# EAGLE design xboxhdmi (EAGLE 9.6.2)
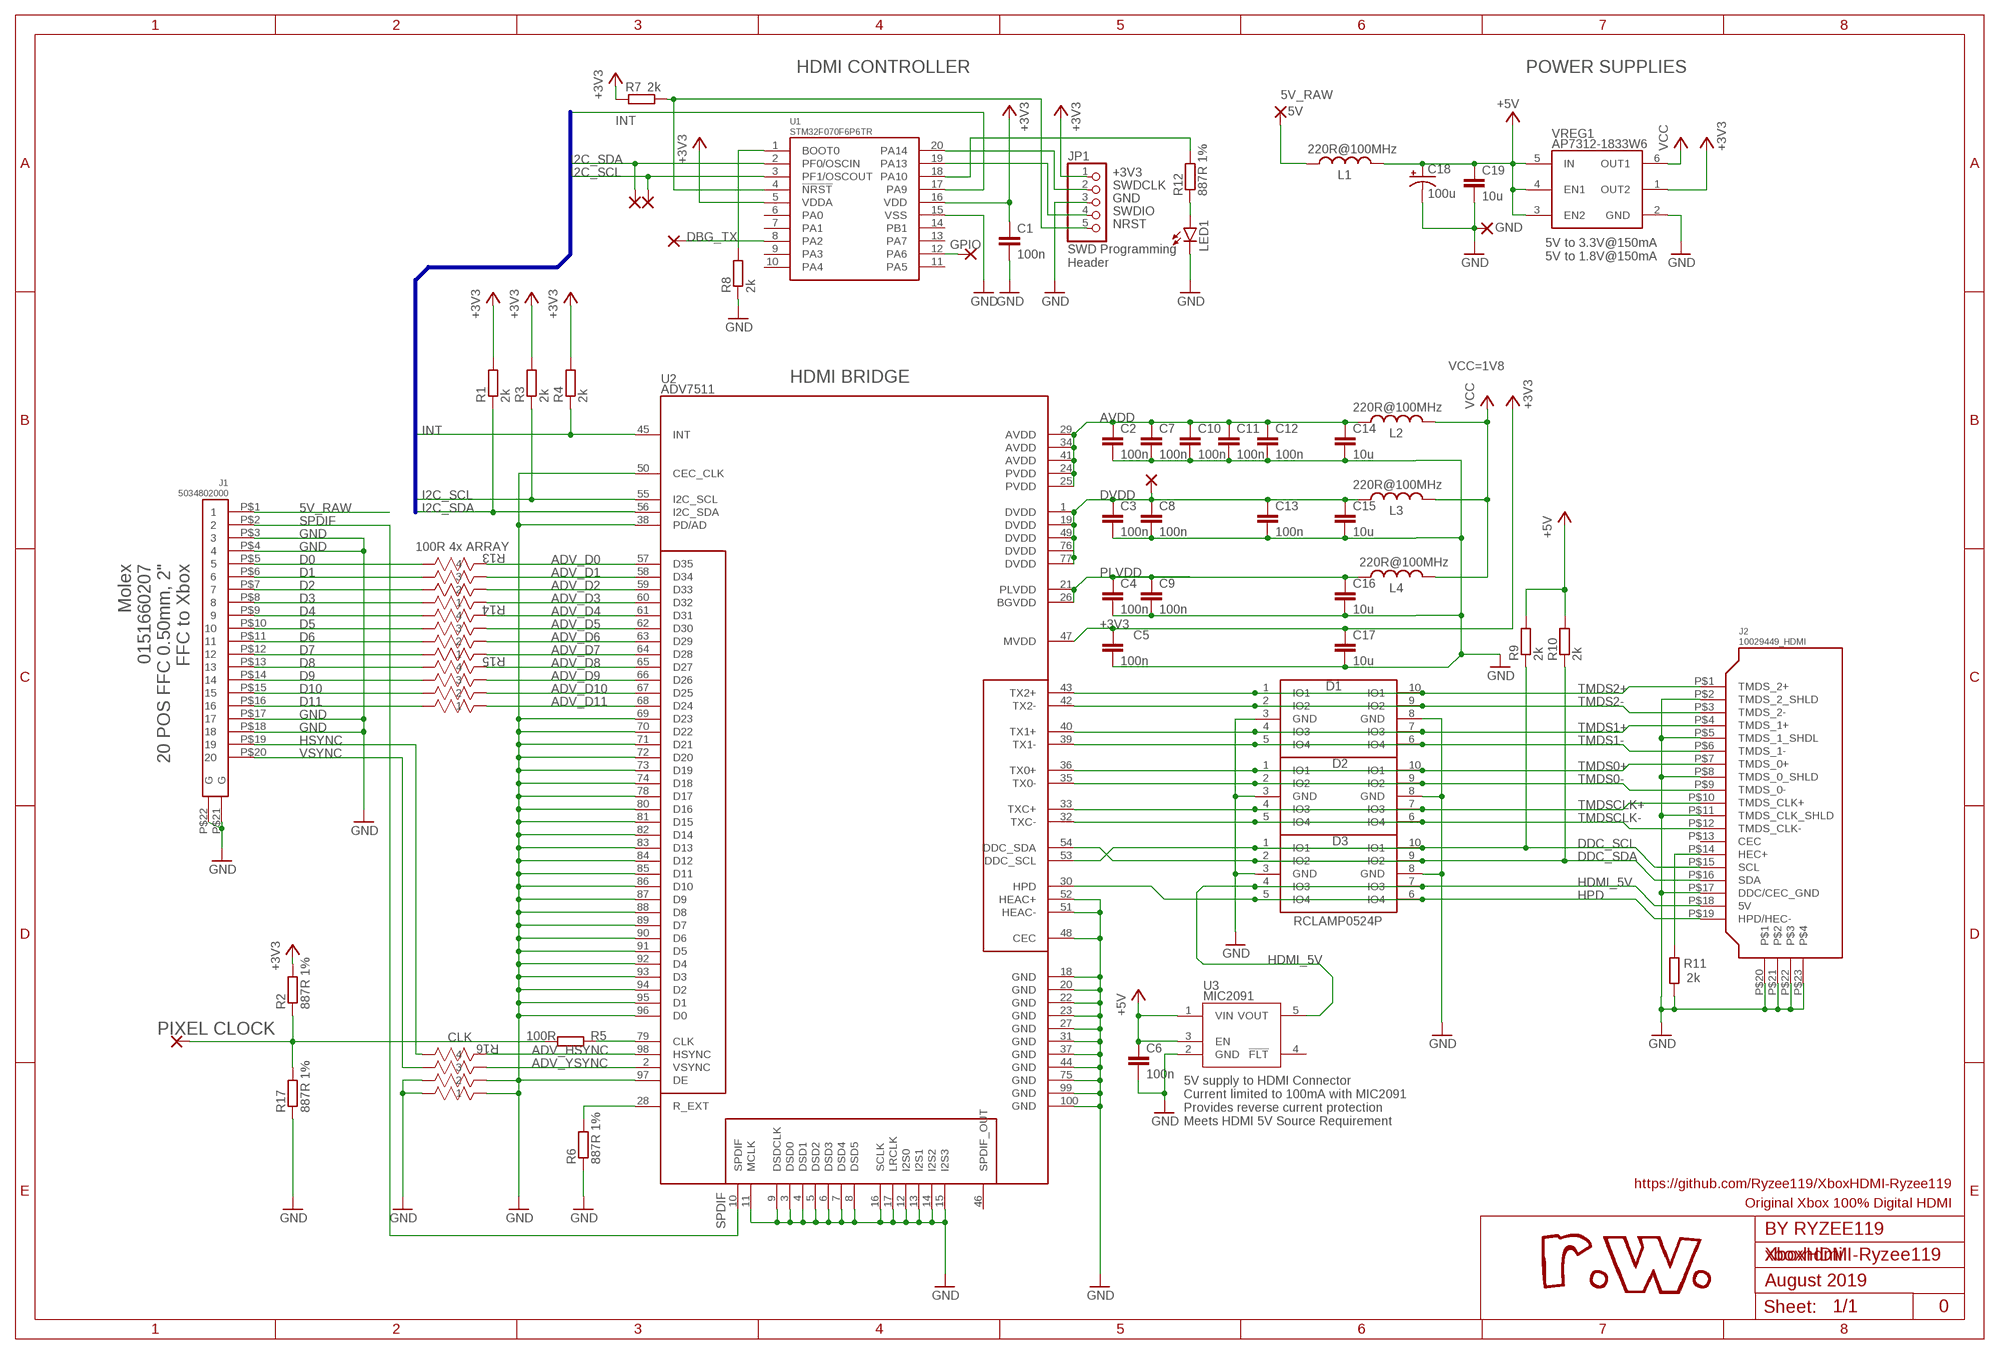
[diagram p0: schematic, sheet 1]

## Parts
1V8  SMD2  [SMD1,27-2,54]
5V  SMD2  [SMD1,27-2,54]
C1  100n  C-EUC0603  [C0603]
C2  100n  C-EUC0603  [C0603]
C3  100n  C-EUC0603  [C0603]
C4  100n  C-EUC0603  [C0603]
C5  100n  C-EUC0603  [C0603]
C6  100n  C-EUC0603  [C0603]
C7  100n  C-EUC0603  [C0603]
C8  100n  C-EUC0603  [C0603]
C9  100n  C-EUC0603  [C0603]
C10  100n  C-EUC0603  [C0603]
C11  100n  C-EUC0603  [C0603]
C12  100n  C-EUC0603  [C0603]
C13  100n  C-EUC0603  [C0603]
C14  10u  C-EUC1206  [C1206]
C15  10u  C-EUC1206  [C1206]
C16  10u  C-EUC1206  [C1206]
C17  10u  C-EUC1206  [C1206]
C18  100u  CPOL-US153CLV-0505  [153CLV-0505]
C19  10u  C-EUC1206  [C1206]
CLK  SMD2  [SMD1,27-2,54]
D1  RCLAMP0524P  [DIOCAF50P250X100X65-10]
D2  RCLAMP0524P  [DIOCAF50P250X100X65-10]
D3  RCLAMP0524P  [DIOCAF50P250X100X65-10]
GND  SMD2  [SMD1,27-2,54]
J1  5034802000  [5034802000]
J2  10029449_HDMI  [HDMI_10029449]
JP1  PINHD-1X5  [1X05]
L1  220R@100MHz  INDUCTOR-0603  [C0603]
L2  220R@100MHz  INDUCTOR-0603  [C0603]
L3  220R@100MHz  INDUCTOR-0603  [C0603]
L4  220R@100MHz  INDUCTOR-0603  [C0603]
LED1  LEDCHIP-LED0603  [CHIP-LED0603]
PAD3  SMD2  [SMD1,27-2,54]
PAD4  SMD2  [SMD1,27-2,54]
PAD5  SMD2  [SMD1,27-2,54]
R1  2k  R-EU_R0603  [R0603]
R2  887R 1%  R-EU_R0603  [R0603]
R3  2k  R-EU_R0603  [R0603]
R4  2k  R-EU_R0603  [R0603]
R5  100R  R-EU_R0603  [R0603]
R6  887R 1%  R-EU_R0603  [R0603]
R7  2k  R-EU_R0603  [R0603]
R8  2k  R-EU_R0603  [R0603]
R9  2k  R-EU_R0603  [R0603]
R10  2k  R-EU_R0603  [R0603]
R11  2k  R-EU_R0603  [R0603]
R12  887R 1%  R-EU_R0603  [R0603]
R13  YC124-JR-0733RL  [YAG_YC124]
R14  YC124-JR-0733RL  [YAG_YC124]
R15  YC124-JR-0733RL  [YAG_YC124]
R16  YC124-JR-0733RL  [YAG_YC124]
R17  887R 1%  R-EU_R0603  [R0603]
TX  SMD2  [SMD1,27-2,54]
U1  STM32F070F6P6TR  [TSSOP20]
U2  ADV7511  [LQFP100]
U3  MIC2091  [SOT23-5]
VREG1  AP7312-1833W6  [SOT23-6]

## Nets
5V_RAW: 5V.1(P) J1.P$1 L1.1
+3V3: C1.1 C5.1 C17.1 JP1.1 R1.2 R2.2 R3.2 R4.2 R7.2 U1.5(VDDA) U1.16(VDD) U2.47(MVDD) VREG1.1(OUT2)
+5V: C6.1 C18.+ C19.1 L1.2 R9.2 R10.2 U3.1(VIN) U3.3(EN) VREG1.3(EN2) VREG1.4(EN1) VREG1.5(IN)
ADV_CLK: R5.1 U2.79(CLK)
ADV_D0: R13.4 U2.57(D35)
ADV_D1: R13.3 U2.58(D34)
ADV_D2: R13.2 U2.59(D33)
ADV_D3: R13.1 U2.60(D32)
ADV_D4: R14.4 U2.61(D31)
ADV_D5: R14.3 U2.62(D30)
ADV_D6: R14.2 U2.63(D29)
ADV_D7: R14.1 U2.64(D28)
ADV_D8: R15.4 U2.65(D27)
ADV_D9: R15.3 U2.66(D26)
ADV_D10: R15.2 U2.67(D25)
ADV_D11: R15.1 U2.68(D24)
ADV_HSYNC: R16.4 U2.98(HSYNC)
ADV_YSYNC: R16.3 U2.2(VSYNC)
AVDD: C2.1 C7.1 C10.1 C11.1 C12.1 C14.1 L2.1 U2.24(PVDD) U2.25(PVDD) U2.29(AVDD) U2.34(AVDD) U2.41(AVDD)
CLK: CLK.1(P) R2.1 R5.2 R17.2
D0: J1.P$5 R13.5
D1: J1.P$6 R13.6
D2: J1.P$7 R13.7
D3: J1.P$8 R13.8
D4: J1.P$9 R14.5
D5: J1.P$10 R14.6
D6: J1.P$11 R14.7
D7: J1.P$12 R14.8
D8: J1.P$13 R15.5
D9: J1.P$14 R15.6
D10: J1.P$15 R15.7
D11: J1.P$16 R15.8
DBG_TX: TX.1(P) U1.8(PA2)
DDC_SCL: D3.1(IO1) D3.10(IO1) J2.P$15(SCL) R9.1 U2.53(DDC_SCL)
DDC_SDA: D3.2(IO2) D3.9(IO2) J2.P$16(SDA) R10.1 U2.54(DDC_SDA)
DVDD: 1V8.1(P) C3.1 C8.1 C13.1 C15.1 L3.1 U2.1(DVDD) U2.19(DVDD) U2.49(DVDD) U2.76(DVDD) U2.77(DVDD)
GND: C1.2 C2.2 C3.2 C4.2 C5.2 C6.2 C7.2 C8.2 C9.2 C10.2 C11.2 C12.2 C13.2 C14.2 C15.2 C16.2 C17.2 C18.- C19.2 D1.3(GND) D1.8(GND) D2.3(GND) D2.8(GND) D3.3(GND) D3.8(GND) GND.1(P) J1.P$3 J1.P$4 J1.P$17 J1.P$18 J1.P$21(G) J1.P$22(G) J2.P$2(TMDS_2_SHLD) J2.P$5(TMDS_1_SHDL) J2.P$8(TMDS_0_SHLD) J2.P$11(TMDS_CLK_SHLD) J2.P$17(DDC/CEC_GND) J2.P$20 J2.P$21 J2.P$22 J2.P$23 JP1.3 LED1.C R6.1 R8.1 R11.1 R16.1 R16.2 R16.7 R16.8 R17.1 U1.15(VSS) U2.3(DSD0) U2.4(DSD1) U2.5(DSD2) U2.6(DSD3) U2.7(DSD4) U2.8(DSD5) U2.9(DSDCLK) U2.11(MCLK) U2.12(I2S0) U2.13(I2S1) U2.14(I2S2) U2.15(I2S3) U2.16(SCLK) U2.17(LRCLK) U2.18(GND) U2.20(GND) U2.22(GND) U2.23(GND) U2.27(GND) U2.31(GND) U2.37(GND) U2.38(PD/AD) U2.44(GND) U2.48(CEC) U2.50(CEC_CLK) U2.51(HEAC-) U2.52(HEAC+) U2.69(D23) U2.70(D22) U2.71(D21) U2.72(D20) U2.73(D19) U2.74(D18) U2.75(GND) U2.78(D17) U2.80(D16) U2.81(D15) U2.82(D14) U2.83(D13) U2.84(D12) U2.85(D11) U2.86(D10) U2.87(D9) U2.88(D8) U2.89(D7) U2.90(D6) U2.91(D5) U2.92(D4) U2.93(D3) U2.94(D2) U2.95(D1) U2.96(D0) U2.97(DE) U2.99(GND) U2.100(GND) U3.2(GND) VREG1.2(GND)
GPIO: PAD5.1(P) U1.12(PA6)
HDMI_5V: D3.4(IO3) D3.7(IO3) J2.P$18(5V) U3.5(VOUT)
HEC+: J2.P$14(HEC+) R11.2
HPD: D3.5(IO4) D3.6(IO4) J2.P$19(HPD/HEC-) U2.30(HPD)
HSYNC: J1.P$19 R16.5
I2C_SCL: PAD4.1(P) R3.1 U1.3(PF1/OSCOUT) U2.55(I2C_SCL)
I2C_SDA: PAD3.1(P) R1.1 U1.2(PF0/OSCIN) U2.56(I2C_SDA)
INT: R4.1 U1.17(PA9) U2.45(INT)
N$5: R12.2 U1.18(PA10)
N$6: LED1.A R12.1
N$35: R8.2 U1.1(BOOT0)
NRST: JP1.5 R7.1 U1.4(!NRST)
PLVDD: C4.1 C9.1 C16.1 L4.1 U2.21(PLVDD) U2.26(BGVDD)
R_EXT: R6.2 U2.28(R_EXT)
SPDIF: J1.P$2 U2.10(SPDIF)
SWDCLK: JP1.2 U1.20(PA14)
SWDIO: JP1.4 U1.19(PA13)
TMDS0+: D2.1(IO1) D2.10(IO1) J2.P$7(TMDS_0+) U2.36(TX0+)
TMDS0-: D2.2(IO2) D2.9(IO2) J2.P$9(TMDS_0-) U2.35(TX0-)
TMDS1+: D1.4(IO3) D1.7(IO3) J2.P$4(TMDS_1+) U2.40(TX1+)
TMDS1-: D1.5(IO4) D1.6(IO4) J2.P$6(TMDS_1-) U2.39(TX1-)
TMDS2+: D1.1(IO1) D1.10(IO1) J2.P$1(TMDS_2+) U2.43(TX2+)
TMDS2-: D1.2(IO2) D1.9(IO2) J2.P$3(TMDS_2-) U2.42(TX2-)
TMDSCLK+: D2.4(IO3) D2.7(IO3) J2.P$10(TMDS_CLK+) U2.33(TXC+)
TMDSCLK-: D2.5(IO4) D2.6(IO4) J2.P$12(TMDS_CLK-) U2.32(TXC-)
VCC: L2.2 L3.2 L4.2 VREG1.6(OUT1)
VSYNC: J1.P$20 R16.6
Unconnected: J2.P$13(CEC) U1.6(PA0) U1.7(PA1) U1.9(PA3) U1.10(PA4) U1.11(PA5) U1.13(PA7) U1.14(PB1) U2.46(SPDIF_OUT) U3.4(!FLT)

## Buses
I2C_SCL,I2C_SDA,INT

## Notes on the sheet
- HDMI CONTROLLER | POWER SUPPLIES
- 5V to 3.3V@150mA
  5V to 1.8V@150mA
- SWD Programming
  Header
- VCC=1V8
- HDMI BRIDGE
- 100R 4x ARRAY
- Molex
  0151660207
  20 POS FFC 0.50mm, 2"
  FFC to Xbox
- PIXEL CLOCK
- 5V supply to HDMI Connector
  Current limited to 100mA with MIC2091
  Provides reverse current protection
  Meets HDMI 5V Source Requirement
- https://github.com/Ryzee119/XboxHDMI-Ryzee119
- Original Xbox 100% Digital HDMI
- BY RYZEE119
- XboxHDMI-Ryzee119
- August 2019
- 0

## Library data of the parts
1V8 5V CLK GND PAD3-PAD5 TX = my-library:SMD2: SMD PAD
C1-C17 C19 = rcl:C-EU: CAPACITOR, European symbol; SPICEPREFIX: C
C18 = rcl:CPOL-US: POLARIZED CAPACITOR, American symbol; SPICEPREFIX: C
D1-D3 = my-library:RCLAMP0524P
J1 = my-library:5034802000
J2 = my-library:10029449_HDMI
JP1 = pinhead:PINHD-1X5: PIN HEADER
L1-L4 = my-library:INDUCTOR-0603
LED1 = led:LED: LED OSRAM: - CHIPLED LG R971, LG N971, LY N971, LG Q971, LY Q971, LO R971, LY R971 LH N974, LH R974 LS Q976, LO Q976, LY Q976 LO Q996 - Hyper CHIPLED LW Q18S LB Q993, LB Q99A, LB R99A - SideLED LS A670, LO A670, LY A670, LG A670, LP A670 LB A673, LV A673, LT A673, LW A673 LH A674 LY A675 LS A676, LA A676, LO A676, LY A676, LW A676 LS A679, LY A679, LG A679 - Hyper Micro SIDELED® LS Y876, LA Y876, LO Y876, LY Y876 LT Y87S - SmartLED LW L88C, LW L88S LB L89C, LB L89S, LG L890 LS L89K, LO L89K, LY L89K LS L896, LA L896, LO L896, LY L896 - TOPLED LS T670, LO T670, LY T670, LG T670, LP T670 LSG T670, LSP T670, LSY T670, LOP T670, LYG T670 LG T671, LOG T671, LSG T671 LB T673, LV T673, LT T673, LW T673 LH T674 LS T676, LA T676, LO T676, LY T676, LB T676, LH T676, LSB T676, LW T676 LB T67C, LV T67C, LT T67C, LS T67K, LO T67K, LY T67K, LW E67C LS E67B, LA E67B, LO E67B, LY E67B, LB E67C, LV E67C, LT E67C LW T67C LS T679, LY T679, LG T679 LS T770, LO T770, LY T770, LG T770, LP T770 LB T773, LV T773, LT T773, LW T773 LH T774 LS E675, LA E675, LY E675, LS T675 LS T776, LA T776, LO T776, LY T776, LB T776 LHGB T686 LT T68C, LB T68C - Hyper Mini TOPLED® LB M676 - Mini TOPLED Santana® LG M470 LS M47K, LO M47K, LY M47K Source: http://www.osram.convergy.de LUXEON: - LUMILED® LXK2-PW12-R00, LXK2-PW12-S00, LXK2-PW14-U00, LXK2-PW14-V00 LXK2-PM12-R00, LXK2-PM12-S00, LXK2-PM14-U00 LXK2-PE12-Q00, LXK2-PE12-R00, LXK2-PE12-S00, LXK2-PE14-T00, LXK2-PE14-U00 LXK2-PB12-K00, LXK2-PB12-L00, LXK2-PB12-M00, LXK2-PB14-N00, LXK2-PB14-P00, LXK2-PB14-Q00 LXK2-PR12-L00, LXK2-PR12-M00, LXK2-PR14-Q00, LXK2-PR14-R00 LXK2-PD12-Q00, LXK2-PD12-R00, LXK2-PD12-S00 LXK2-PH12-R00, LXK2-PH12-S00 LXK2-PL12-P00, LXK2-PL12-Q00, LXK2-PL12-R00 Source: www.luxeon.com KINGBRIGHT: KA-3528ASYC Source: www.kingbright.com
R1-R12 R17 = rcl:R-EU_: RESISTOR, European symbol; SPICEPREFIX: R
R13-R16 = my-library:YC124-JR-0733RL; MANUFACTURER_PART_NUMBER: YC124JR0733RL; VENDOR: Yageo
U1 = my-library:STM32F070F6P6TR
U2 = my-library:ADV7511
U3 = my-library:MIC2091
VREG1 = my-library:AP7312-1833W6

## Board
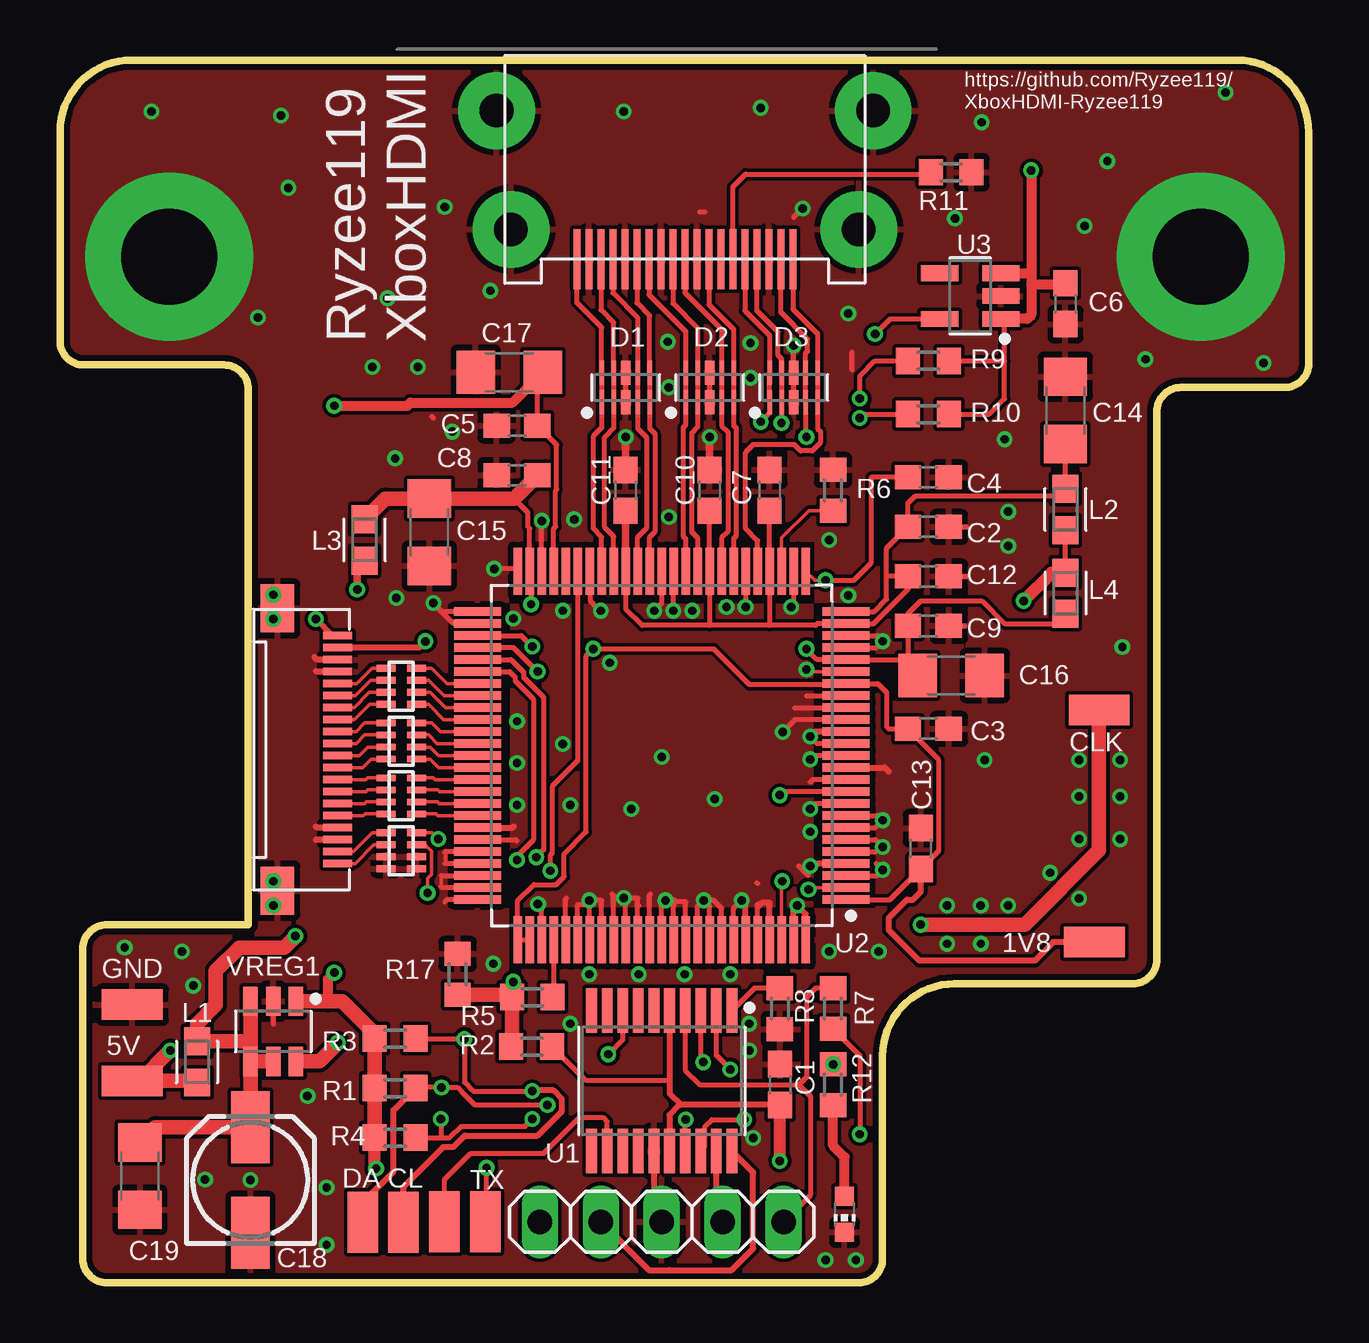
[diagram p1: board, top side]
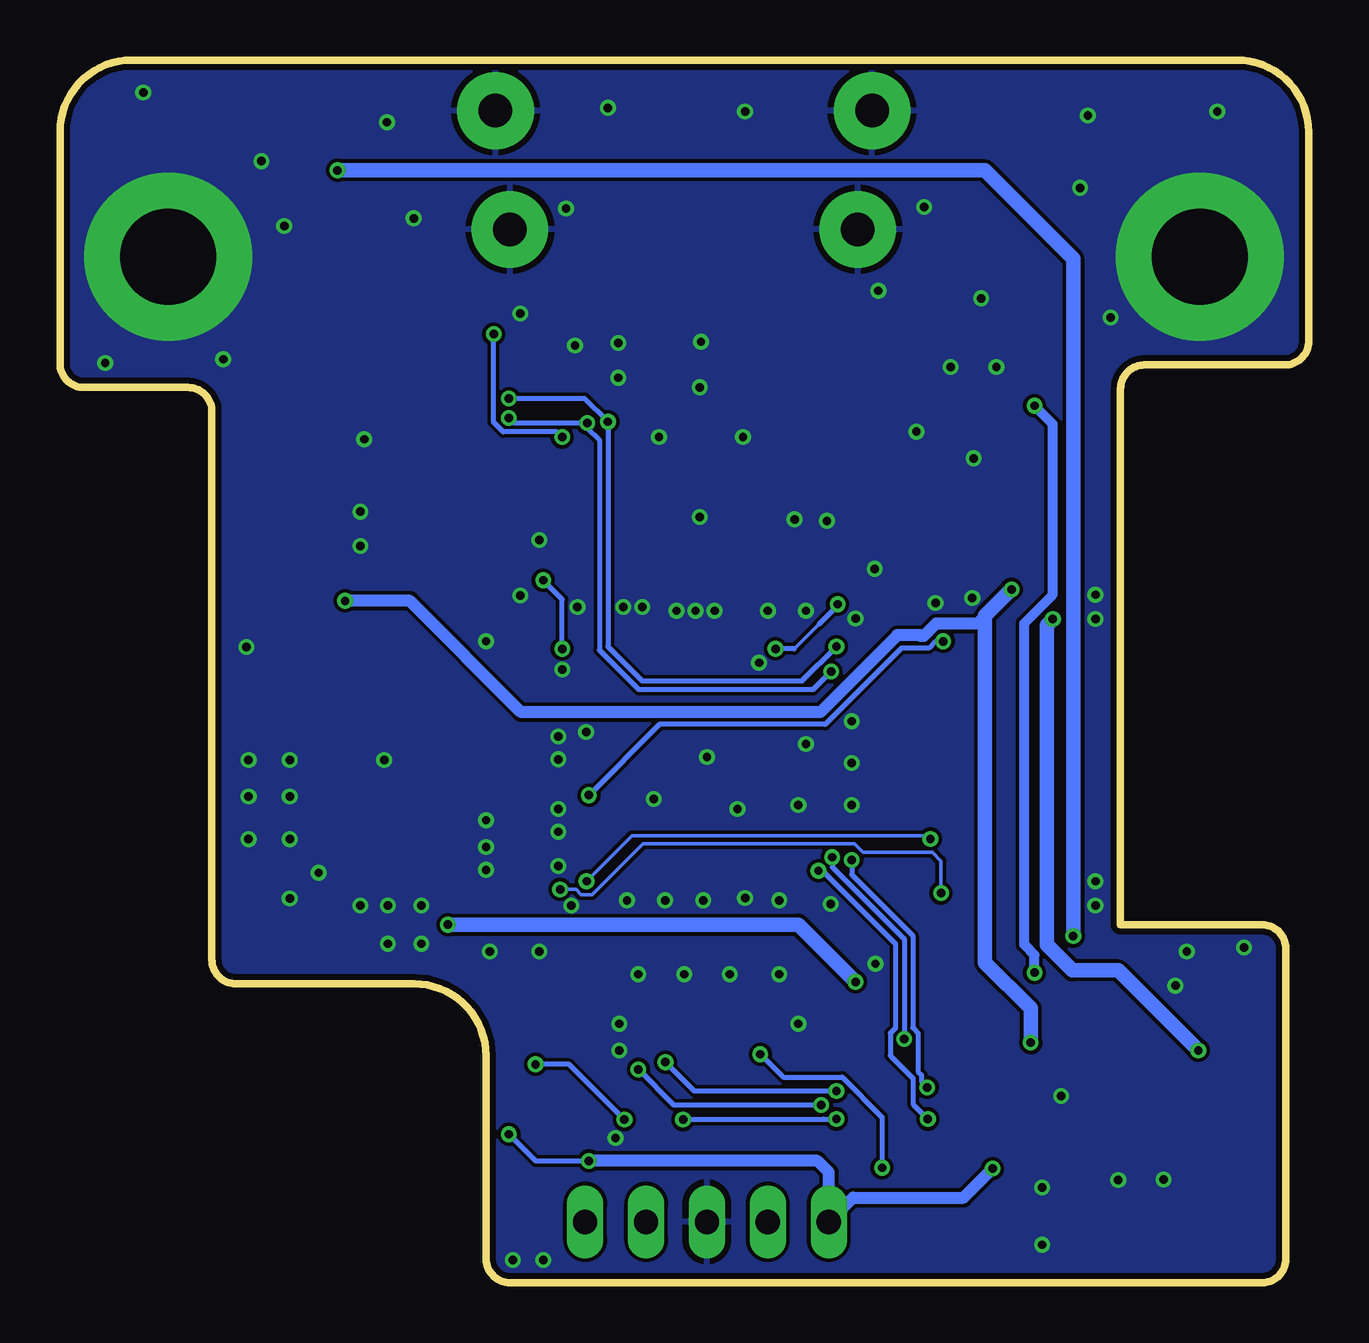
[diagram p2: board, bottom side, seen from below]

Size 52.05 x 50.95 mm. Coordinates in mm from the lower left corner, seen from the top.
Outline: 0.95,13.92 0.95,1 arc90 1.95,0 33.29,0 arc90 34.29,1 34.29,9.46 arc-90 37.29,12.46 44.72,12.46 arc90 45.72,13.46 45.72,36.31 arc-90 46.72,37.31 51.05,37.31 arc90 52.05,38.31 52.05,47.95 arc90 49.05,50.95 3,50.95 arc90 0,47.95 0,39.24 arc90 1,38.24 6.84,38.24 arc-90 7.84,37.24 7.84,14.92 1.95,14.92 arc90 0.95,13.92
Copper layers (1*16): Top 0.035mm / dielectric 1.5mm / Bottom 0.035mm
Design rules "Elecrow_2-layer_eagle_rule": minimum track width 6mil, minimum drill 12mil, track to track 6mil, track to pad 6mil, pad to pad 6mil, via to via 6mil, smd to smd 0mil, copper to edge 10mil, drill to drill 10mil, minimum pad ring 10mil, minimum via ring 6mil, stop-mask expansion 2mil, vias tented up to drill 100mil, thermal gap 10mil

### Footprints (pad centres in the part's own frame; a part is rotated, then mirrored left to right if it is on the bottom)
SMD1,27-2,54 = smd 1.27 x 2.54: 1 0,0
C0603 = smd 1.1 x 1: 1 -0.85,0; 2 0.85,0
C1206 = smd 1.6 x 1.8: 1 -1.4,0; 2 1.4,0
153CLV-0505 = smd 3 x 1.6: + 2.2,0; - -2.2,0
DIOCAF50P250X100X65-10 = smd 1.005 x 0.2: 1 -0.612,1; 2 -0.612,0.5; 4 -0.612,-0.5; 5 -0.612,-1; 6 0.612,-1; 7 0.612,-0.5; 9 0.612,0.5; 10 0.612,1 | smd 1.005 x 0.4: 3 -0.612,0; 8 0.612,0
5034802000 = smd 0.3 x 1.2: P$1 -4.75,0; P$2 -4.25,0; P$3 -3.75,0; P$4 -3.25,0; P$5 -2.75,0; P$6 -2.25,0; P$7 -1.75,0; P$8 -1.25,0; P$9 -0.75,0; P$10 -0.25,0; P$11 0.25,0; P$12 0.75,0; P$13 1.25,0; P$14 1.75,0; P$15 2.25,0; P$16 2.75,0; P$17 3.25,0; P$18 3.75,0; P$19 4.25,0; P$20 4.75,0 | smd 2 x 1.4: P$21 -5.881,-2.5; P$22 5.881,-2.5
HDMI_10029449 = smd 0.3 x 2.5: P$1 4.5,0; P$2 4,0; P$3 3.5,0; P$4 3,0; P$5 2.5,0; P$6 2,0; P$7 1.5,0; P$8 1,0; P$9 0.5,0; P$10 0,0; P$11 -0.5,0; P$12 -1,0; P$13 -1.5,0; P$14 -2,0; P$15 -2.5,0; P$16 -3,0; P$17 -3.5,0; P$18 -4,0; P$19 -4.5,0 | drill 1.4 pad 3.2: P$20 -7.25,-1.25; P$21 7.25,-1.25; P$22 7.85,-6.2; P$23 -7.85,-6.2
1X05 = drill 1.016 long: 1 -5.08,0; 2 -2.54,0; 3 0,0; 4 2.54,0; 5 5.08,0
C0603' = smd 1.166 x 1.087: 1 -0.86,0; 2 0.86,0
CHIP-LED0603 = smd 0.8 x 0.8: A 0,-0.75; C 0,0.75
R0603 = smd 1 x 1.1: 1 -0.85,0; 2 0.85,0
YAG_YC124 = smd 0.8 x 0.28: 1 -0.635,0.75; 2 -0.635,0.25; 3 -0.635,-0.25; 4 -0.635,-0.75; 5 0.635,-0.75; 6 0.635,-0.25; 7 0.635,0.25; 8 0.635,0.75
TSSOP20 = smd 1.859 x 0.447: 1 -2.928,2.925; 2 -2.928,2.275; 3 -2.928,1.625; 4 -2.928,0.975; 5 -2.928,0.325; 6 -2.928,-0.325; 7 -2.928,-0.975; 8 -2.928,-1.625; 9 -2.928,-2.275; 10 -2.928,-2.925; 11 2.928,-2.925; 12 2.928,-2.275; 13 2.928,-1.625; 14 2.928,-0.975; 15 2.928,-0.325; 16 2.928,0.325; 17 2.928,0.975; 18 2.928,1.625; 19 2.928,2.275; 20 2.928,2.925
LQFP100 = smd 1.952 x 0.34: 1 -7.682,6; 2 -7.682,5.5; 3 -7.682,5; 4 -7.682,4.5; 5 -7.682,4; 6 -7.682,3.5; 7 -7.682,3; 8 -7.682,2.5; 9 -7.682,2; 10 -7.682,1.5; 11 -7.682,1; 12 -7.682,0.5; 13 -7.682,0; 14 -7.682,-0.5; 15 -7.682,-1; 16 -7.682,-1.5; 17 -7.682,-2; 18 -7.682,-2.5; 19 -7.682,-3; 20 -7.682,-3.5; 21 -7.682,-4; 22 -7.682,-4.5; 23 -7.682,-5; 24 -7.682,-5.5; 25 -7.682,-6; 51 7.682,-6; 52 7.682,-5.5; 53 7.682,-5; 54 7.682,-4.5; 55 7.682,-4; 56 7.682,-3.5; 57 7.682,-3; 58 7.682,-2.5; 59 7.682,-2; 60 7.682,-1.5; 61 7.682,-1; 62 7.682,-0.5; 63 7.682,0; 64 7.682,0.5; 65 7.682,1; 66 7.682,1.5; 67 7.682,2; 68 7.682,2.5; 69 7.682,3; 70 7.682,3.5; 71 7.682,4; 72 7.682,4.5; 73 7.682,5; 74 7.682,5.5; 75 7.682,6 | smd 0.34 x 1.952: 26 -6,-7.682; 27 -5.5,-7.682; 28 -5,-7.682; 29 -4.5,-7.682; 30 -4,-7.682; 31 -3.5,-7.682; 32 -3,-7.682; 33 -2.5,-7.682; 34 -2,-7.682; 35 -1.5,-7.682; 36 -1,-7.682; 37 -0.5,-7.682; 38 0,-7.682; 39 0.5,-7.682; 40 1,-7.682; 41 1.5,-7.682; 42 2,-7.682; 43 2.5,-7.682; 44 3,-7.682; 45 3.5,-7.682; 46 4,-7.682; 47 4.5,-7.682; 48 5,-7.682; 49 5.5,-7.682; 50 6,-7.682; 76 6,7.682; 77 5.5,7.682; 78 5,7.682; 79 4.5,7.682; 80 4,7.682; 81 3.5,7.682; 82 3,7.682; 83 2.5,7.682; 84 2,7.682; 85 1.5,7.682; 86 1,7.682; 87 0.5,7.682; 88 0,7.682; 89 -0.5,7.682; 90 -1,7.682; 91 -1.5,7.682; 92 -2,7.682; 93 -2.5,7.682; 94 -3,7.682; 95 -3.5,7.682; 96 -4,7.682; 97 -4.5,7.682; 98 -5,7.682; 99 -5.5,7.682; 100 -6,7.682
SOT23-5 = smd 1.559 x 0.649: 1 -1.278,0.95; 2 -1.278,0; 3 -1.278,-0.95; 4 1.278,-0.95; 5 1.278,0.95
SOT23-6 = smd 1.217 x 0.609: 1 -1.252,0.95; 2 -1.252,0; 3 -1.252,-0.95; 4 1.252,-0.95; 5 1.252,0; 6 1.252,0.95

### Placement (x,y rotation side)
1V8  43.12,14.19 90 top
5V  3.02,8.41 90 top
C1  30.02,8.26 90 top
C2  36.2,31.5 0 top
C3  36.2,23.08 0 top
C4  36.2,33.56 0 top
C5  19.05,35.72 180 top
C6  41.91,40.8 270 top
C7  29.58,33.02 90 top
C8  19.05,33.66 180 top
C9  36.2,27.37 0 top
C10  27.08,33.02 90 top
C11  23.58,33.02 90 top
C12  36.2,29.43 0 top
C13  35.88,18.1 90 top
C14  41.91,36.35 90 top
C15  15.4,31.27 270 top
C16  37.15,25.3 0 top
C17  18.73,37.94 180 top
C18  7.94,4.29 90 top
C19  3.33,4.44 270 top
CLK  43.31,23.86 90 top
D1  23.58,37.31 90 top
D2  27.08,37.31 90 top
D3  30.58,37.31 90 top
GND  3.02,11.59 90 top
J1  11.57,22.22 270 top
J2  26.05,42.64 180 top
JP1  25.08,2.54 0 top
L1  220R@100MHz  [C0603']  5.71,9.21 90 top
L2  220R@100MHz  [C0603']  41.91,32.23 270 top
L3  220R@100MHz  [C0603']  12.7,30.96 270 top
L4  220R@100MHz  [C0603']  41.91,28.73 90 top
LED1  32.7,2.86 180 top
PAD3  12.62,2.53 180 top
PAD4  14.32,2.53 180 top
PAD5  16.02,2.55 0 top
R1  13.97,8.11 180 top
R2  19.66,9.84 0 top
R3  13.97,10.18 180 top
R4  13.97,6.05 180 top
R5  19.68,11.91 180 top
R6  32.23,33.02 270 top
R7  32.23,11.43 270 top
R8  30,11.42 90 top
R9  36.2,38.42 0 top
R10  36.2,36.2 0 top
R11  37.15,46.28 180 top
R12  32.23,8.25 90 top
R13  14.22,24.86 180 top
R14  14.22,22.57 180 top
R15  14.22,20.29 180 top
R16  14.22,18 180 top
R17  16.57,12.86 270 top
TX  17.72,2.54 180 top
U1  25.08,8.41 270 top
U2  25.08,21.97 180 top
U3  37.94,41.12 180 top
VREG1  8.89,10.48 270 top

### Tracks (layer width: path | path; a pad name or v marks a point on that pad's centre or on a via)
5V_RAW  (via drill 0.35)
  Top 0.254: J1.P$1 11.35,26.97 v10.67,27.65
  Top 0.61: L1.1 5.65,8.41 5V.1 3.33,8.41 v4.6,9.68
  Bottom 0.61: v4.6,9.68 7.94,13.02 9.86,13.02 10.92,14.08 10.92,27.4 v10.67,27.65
+3V3  (via drill 0.35)
  Top 0.2: U2.47 20.58,31.43 20.66,31.51 20.66,33.01 20.7,33.05 20.7,34.92 C5.1 19.9,37.71 19.99,37.8 C17.1 | R2.2 21.91,8.45 25.41,8.45 | R7.2 33.34,9.47 v33.34,6.19
  Top 0.254: C1.1 25.88,7.41 | 25.88,7.41 25.83,7.41 25.4,6.99 U1.16 | U1.5 25.41,8.45 25.41,7.88 25.88,7.41
  Top 0.406: 19.99,37.8 18.86,36.67 14.61,36.67 14.48,36.54 v11.43,36.54 | 11.18,11.73 11.18,12.67 v11.43,12.92
  Top 0.508: v30,5.08 30,7.4 C1.1 | v13.18,4.76 13.12,4.82 R4.2
  Top 0.61: VREG1.1 11.18,11.73 11.77,11.73 13.12,10.38 R3.2 R1.2 R4.2
  Bottom 0.2: v33.34,6.19 32.23,5.08 v30,5.08
  Bottom 0.406: v11.43,12.92 11.43,13.66 11.86,14.09 11.86,27.48 10.67,28.67 10.67,35.78 v11.43,36.54
  Bottom 0.508: v30,5.08 20.48,5.08 20,4.6 JP1.1 18.99,3.55 14.39,3.55 v13.18,4.76
+5V  (via drill 0.35)
  Top 0.2: R10.2 38.73,36.2 39.37,36.83 39.37,38.42 | 39.37,38.42 39.37,40.02 U3.1 | R9.2 39.37,38.42
  Top 0.406: v40.48,46.36 40.48,42.07 | 40.48,42.07 40.48,41.59 | 40.48,41.59 40.48,40.32 40.32,40.16 U3.1 | U3.3 40.48,42.07 | C6.1 41.85,41.59 40.48,41.59
  Top 0.61: v9.81,14.45 9.34,13.97 7.46,13.97 6.5,13.01 6.5,11.58 5.71,10.8 L1.2 7.87,10.07 7.94,10 | VREG1.5 VREG1.4 | VREG1.4 7.94,10 | 7.94,10 VREG1.3 | VREG1.4 7.94,7.56 8.37,7.13 8.37,6.5 7.95,6.5 C18.+ 3.98,6.49 C19.1
  Bottom 0.61: v9.81,14.45 9.81,23.43 9.81,26.51 9.81,42.67 13.49,46.36 v40.48,46.36
ADV_CLK
  Top 0.2: U2.79 20.58,11.95 arc-90 R5.1
ADV_D0
  Top 0.152: R13.4 15.49,25.61 16.13,24.97 U2.57
ADV_D1
  Top 0.152: U2.58 16.01,24.47 15.37,25.11 R13.3
ADV_D2
  Top 0.152: U2.59 16.07,23.97 15.43,24.61 R13.2
ADV_D3
  Top 0.152: U2.60 15.99,23.47 15.36,24.11 R13.1
ADV_D4
  Top 0.152: U2.61 15.86,22.97 15.49,23.34 14.87,23.34 R14.4
ADV_D5
  Top 0.152: U2.62 15.72,22.47 15.37,22.83 R14.3
ADV_D6
  Top 0.152: U2.63 15.78,21.97 15.43,22.32 R14.2
ADV_D7
  Top 0.152: U2.64 15.77,21.47 15.42,21.82 R14.1
ADV_D8
  Top 0.152: U2.65 15.64,20.97 15.56,21.05 14.87,21.05 R15.4
ADV_D9
  Top 0.152: U2.66 15.82,20.47 15.75,20.54 R15.3
ADV_D10
  Top 0.152: U2.67 15.81,19.97 15.74,20.04 R15.2
ADV_D11
  Top 0.152: U2.68 15.74,19.47 15.67,19.54 R15.1
ADV_HSYNC  (via drill 0.35)
  Top 0.152: R16.4 15.51,18.75 v15.77,18.49 | U2.98 30.08,16.72 v30.1,16.73
  Bottom 0.152: v15.77,18.49 15.9,18.62 28.21,18.62 v30.1,16.73
ADV_YSYNC  (via drill 0.35)
  Top 0.152: R16.3 15.23,18.25 15.49,17.99 15.49,17.02 15.32,16.85 v15.32,16.24 | U2.2 31.28,16.47 v31.2,16.39
  Bottom 0.152: v15.32,16.24 15.32,17.58 15.68,17.94 18.58,17.94 18.93,18.29 27.76,18.29 29.87,16.18 30.33,16.18 30.54,16.39 v31.2,16.39
AVDD
  Top 0.2: U2.24 33.92,27.47 35.34,28.9 | 33.94,27.97 34.45,28.48 | C2.1 35.34,32.49 35.63,32.77 41.59,32.77 L2.1 | U2.41
  Top 0.203: 35.34,28.9 C12.1 | U2.25 33.94,27.97 | C2.1 34.45,30.6 34.45,29.43 | 34.45,28.48 34.45,29.43 | L2.1 C14.1 | U2.41 23.58,28.08 24.26,27.4 27.08,27.4 | 29.58,27.4 31.49,27.4 31.57,27.47 U2.24 | 29.58,27.4 27.08,27.4 | C12.1 | C12.1 34.45,29.43 | 27.08,27.4 U2.34 C10.1 | 29.58,27.4 U2.29 C7.1
  Top 0.305: U2.41 C11.1
CLK  (via drill 0.35)
  Top 0.2: 18.84,9.87 arc-90 R2.1
  Top 0.406: 18.89,11.96 R5.2
  Top 0.61: 18.84,9.87 R5.2 18.73,12.01 R17.2 | v18.89,12.54 18.89,11.96 | CLK.1 43.31,18.02 40.22,14.92 v35.88,14.92
  Bottom 0.61: v35.88,14.92 21.27,14.92 v18.89,12.54
D0
  Top 0.152: J1.P$5 12.37,24.97 13.01,25.61 R13.5
D1
  Top 0.152: J1.P$6 12.31,24.47 12.95,25.11 R13.6
D2
  Top 0.152: J1.P$7 12.26,23.97 12.89,24.61 R13.7
D3
  Top 0.152: J1.P$8 12.26,23.47 12.9,24.11 R13.8
D4
  Top 0.152: J1.P$9 12.34,22.97 12.7,23.34 13.58,23.34 R14.5
D5
  Top 0.152: J1.P$10 12.34,22.47 12.7,22.83 R14.6
D6
  Top 0.152: J1.P$11 12.48,21.97 12.83,22.32 R14.7
D7
  Top 0.152: J1.P$12 12.61,21.47 12.97,21.82 R14.8
D8
  Top 0.152: J1.P$13 12.75,20.97 12.83,21.05 13.58,21.05 R15.5
D9
  Top 0.152: J1.P$14 12.76,20.47 12.82,20.54 R15.6
D10
  Top 0.152: J1.P$15 12.7,19.97 12.77,20.04 R15.7
D11
  Top 0.152: J1.P$16 12.64,19.47 12.71,19.54 R15.8
DBG_TX  (via drill 0.35)
  Top 0.203: TX.1 17.78,2.91 v17.78,4.79 | U1.8 23.46,10.12 v22.86,9.53
  Bottom 0.2: 17.78,6.45 17.78,6.9 19.45,8.57 21.9,8.57 v22.86,9.53
  Bottom 0.203: 17.78,6.45 v17.78,4.79
DDC_SCL  (via drill 0.35)
  Top 0.2: v29.21,35.88 29.58,36.25 D3.1 D3.10 29.58,39.47 28.55,40.51 J2.P$15 | U2.53 19.23,26.97 v19.68,26.51 | v33.34,36.84 33.34,37.78 33.97,38.42 R9.1
  Bottom 0.2: v19.68,26.51 21.11,25.08 27.78,25.08 29.21,26.51 v29.21,35.88 30.18,36.84 v33.34,36.84
DDC_SDA  (via drill 0.35)
  Top 0.2: v30.07,35.82 30.08,35.83 D3.2 D3.9 30.08,38.5 29.94,38.65 29.94,39.62 29.05,40.51 J2.P$16 | v19.91,25.47 18.91,26.47 U2.54 | v33.34,36.04 33.5,36.2 R10.1
  Bottom 0.2: v19.91,25.47 20.65,24.73 27.93,24.73 29.56,26.37 29.56,35.12 30.07,35.63 v30.07,35.82 33.12,35.82 v33.34,36.04
DVDD  (via drill 0.35)
  Top 0.152: U2.49 19.64,29.6
  Top 0.2: U2.49 19.58,31.43 19.5,31.51 19.5,32.09 18.92,32.67 | 19.64,29.6 v19.64,28.27 | U2.77 U2.76 19.08,15.93 19.74,16.59 20.68,16.59 21.02,16.93 21.02,17.87 21.94,18.79 21.94,26.13 v22.23,26.42 27.24,26.42 28.73,24.92 32.72,24.92 U2.19 34.08,24.97 34.45,24.61 34.45,23.18 34.55,23.08 C3.1 36.63,21.79 36.63,18 C13.1 34.6,15.97 U2.1
  Top 0.203: C3.1
  Top 0.254: 1V8.1 41.4,14.19 40.64,13.43 35.81,13.43 34.54,14.7 34.54,15.21 35.31,15.97 35.56,15.97 35.88,16.29 C13.1
  Top 0.61: L3.1 13.56,32.67 C15.1 18.92,32.67 C8.1
  Bottom 0.152: 20.4,27.46 21.44,26.42
  Bottom 0.2: 21.44,26.42 v22.23,26.42 | 20.4,27.46 19.64,28.22 v19.64,28.27
GND  (via drill 0.35, 4 pad 7)
  Top 0.152: U2.27 30.58,30.43 | 28.58,28.17 v28.57,28.16 | U2.20 31.2,25.47 v31.12,25.56 | 15.91,16.47 15.89,16.5 15.89,16.97 | 16.07,17.97 16.07,17.47
  Top 0.2: C9.2 37.7,27.37 | C12.2 37.78,29.43 | C2.2 37.78,31.5 | D3.3 D3.8 v30.58,39.05 | D2.8 D2.3 | D1.8 D1.3 | U2.48 v20.08,31.75 | v22.07,15.94 21.96,15.83 | 21.96,15.83 21.88,15.75 21.58,15.75 U2.81 | U2.82 22.08,15.7 21.96,15.83 | U2.86 24.08,15.67 24.13,15.72 | U2.84 23.08,16.13 23.02,16.19 | U2.87 24.58,16.17 24.61,16.19 | U2.94 28.08,15.61 v28.42,15.94 | U2.93 27.58,15.6 27.24,15.94 v26.83,15.94 | U2.92 27.08,15.69 v26.83,15.94 | U2.91 26.58,15.69 v26.83,15.94 | 25.65,15.94 v25.24,15.94 25.27,15.91 25.24,15.88 25.08,15.72 U2.88 | 29.08,16.64 29.05,16.67 | U2.9 31.5,19.97 v31.27,19.75 | U2.11 31.39,20.97 31.27,20.86 | U2.13 31.43,21.97 v31.27,21.81 | U2.14 31.57,22.47 v31.27,22.77 | U2.23 34.05,26.97 v34.29,26.73 34.03,26.47 U2.22 | U2.8 34.09,19.47 v34.29,19.27 33.99,18.97 U2.7 | U2.6 33.98,18.47 34.24,18.21 | 34.24,18.21 v34.29,18.16 | 34.03,17.47 v34.29,17.21 34.05,16.97 U2.3 | U2.5 34.01,17.97 34.24,18.21 | U2.96 29.08,15.66 29.17,15.75 | U2.38 25.08,28.32 v24.77,28 | U2.16 30.64,23.47 v30.12,22.95 | U2.17 32.74,23.95 30.62,23.95 | U2.18 32.74,24.45 31.12,24.45 | U2.80 21.08,16 21.11,16.03 | U2.78 20.08,15.62 v19.92,15.78 | U2.71 16.07,17.97 16.03,17.94 | U2.72 16.07,17.47 16.04,17.47 16.03,17.46 | U2.74 15.91,16.47 15.88,16.51 | U2.75 16.13,15.97 16.03,15.88 | 15.89,16.97 U2.73 | U2.70 18.99,18.47 19.05,18.42
  Top 0.203: VREG1.2 8.89,10.8 | 15.5,36.09 15.56,36.04 | 21.58,15.75 21.6,15.77 | U2.52 16.41,27.47 v15.56,28.32 15.91,27.97 U2.51 | 31.19,16.97 30.8,17.37 | U2.50 18.98,29.75 v18.1,29.75 | 26.87,44.61 26.67,44.61 | 30.58,44.39 v30.96,44.77 | 33.02,38.04 33.02,38.79 | U2.44 22.1,29.64 22.1,28.42 22.51,28 v22.54,28 | U2.37 25.56,29.63 v25.56,28 | U2.83 22.58,15.94 v22.07,15.94 | U2.85 23.58,16.03 | 23.58,16.03 v23.5,16.03 | U2.86 24.08,16.03 23.58,16.03 | v25.24,15.94 25.58,15.94 25.58,15.72 | U2.89 25.58,15.88 | 25.58,15.88 25.24,15.88 | U2.90 26.08,15.88 25.58,15.88 | U2.31 28.58,28.17 | U2.27 30.58,28.16 v30.48,28.16
  Top 0.254: U1.15 24.76,3.5 25.08,3.18 JP1.3 | 11.53,25.47 J1.P$4 10.69,25.47 10.67,25.5 | U2.95 28.58,15.77 v28.42,15.94 | U2.97 29.58,15.84 29.26,15.84 29.17,15.75 | 29.17,15.75 29.08,15.75 | 29.08,15.66 29.17,15.75 | U2.99 30.58,15.57 v30.73,15.72 31.08,15.37 U2.100 | U2.4 31.38,17.47 v31.27,17.37 | U2.12 34.38,21.47 34.54,21.3 | U2.15 31.48,22.97 v31.27,22.77 | J1.P$18 10.69,18.47 10.67,18.45 | J1.P$17 10.71,18.97 10.67,19.02 | J1.P$3 10.7,25.97 10.61,26.07 | U2.69 18.88,18.97 18.92,19.02
  Top 0.305: C11.2 v23.58,35.24 | C10.2 v27.08,35.24
  other vias: 4.54,42.76 47.55,42.76 32.07,30.96 26.35,28 27.78,28.16 32.86,28.64 20.96,28 18.89,27.69 20.96,22.45 27.3,20.15 23.81,19.75 31.27,18.8 11.11,1.59 11.11,3.97 7.94,4.29 5.56,12.38 5.08,13.81 2.7,13.97 6.05,4.31 25.08,21.91 21.43,31.81 17.94,41.34 16.03,44.83 23.5,48.8 29.21,48.96 38.42,48.36 48.58,49.59 43.66,46.74 42.7,44.04 37.31,44.36 32.86,40.39 45.24,38.48 50.16,38.32 9.21,48.64 3.81,48.8 9.53,45.62 8.26,40.23 39.37,35.15 39.53,32.13 39.53,30.7 10.32,7.78 28.89,6.03 31.91,0.95 16.35,35.47 13.97,34.35 14.92,38.16 13.02,38.16 13.65,41.02 18.06,13.3 44.28,26.49 14.02,28.53 22.91,25.84 19.05,19.91 19.05,21.65 19.05,23.4 36.98,14.13 38.39,14.13 34.13,13.81 32.07,13.81 22.07,12.86 24.13,12.86 26.04,12.86 27.94,12.86 21.27,10.79 21.27,19.91 25.38,37.31 25.33,39.21 25.38,31.91 28.78,39.16 28.78,37.71 42.47,21.79 38.54,21.79 36.98,15.72 38.38,15.72 39.52,15.72 33.18,0.95 28.73,9.68 28.73,10.79 8.89,28.67 8.89,27.65 8.89,16.73 8.89,15.72 42.47,20.26 42.47,18.49 41.27,17.09 42.47,16.01 44.19,18.49 44.19,20.26 44.19,21.79
  pour Bottom: -12.7,-7.14 57.15,-7.14 57.15,62.71 -12.7,62.71
  pour Top: -1.27,51.28 53.34,51.28 54.61,50.01 54.61,-5.87 -1.13,-5.87 -1.13,51.14
GPIO
  Top 0.2: PAD5.1 16.04,2.57 16.04,4.32 17.12,5.4 20.16,5.4 21.66,6.89 22.63,6.89
  Top 0.203: U1.12 22.81,6.72 22.63,6.89
HDMI_5V  (via drill 0.35)
  Top 0.2: v31.12,35.24 31.08,35.28 D3.4 D3.7 31.08,38.73 31.16,38.81 31.16,39.32 30.05,40.44 J2.P$18 | v33.97,39.53 34.61,40.17 U3.5
  Bottom 0.2: v31.12,35.24 31.33,35.46 33.58,35.46 33.97,35.85 v33.97,39.53
HEC+
  Top 0.2: R11.2 36.22,46.2 28.57,46.2 28.05,45.67 J2.P$14
HPD
  Top 0.2: U2.30 29.08,30.93 28.57,31.43 28.57,34.61 28.89,34.93 30.61,34.93 30.88,34.66 31.36,34.66 31.7,35 31.7,35.48 31.58,35.6 D3.5 31.58,36.83 31.58,37.31 D3.6 31.58,39.54 30.55,40.57 J2.P$19
HSYNC
  Top 0.152: J1.P$19 12.22,17.97 13.01,18.75 R16.5
I2C_SCL  (via drill 0.35)
  Top 0.2: v19.86,17.73 20.16,18.04 | R3.1 16.84,10.18 v16.86,10.16 16.86,8.35 17.22,7.99 v19.68,7.99
  Top 0.203: U1.3 26.71,9.3 v26.82,9.19 | 20.16,18.04 20.16,24.39 19.33,25.23 19.33,25.44 18.8,25.97 U2.55
  Top 0.254: PAD4.1 14.32,4 15.99,5.67 16.41,5.67 16.87,6.13 19.9,6.13 20.93,7.16 20.93,7.66 20.57,8.01 19.71,8.01 v19.68,7.99
  Bottom 0.2: v19.86,17.73 19.86,17.32 16.86,14.32 v16.86,10.16
  Bottom 0.203: v19.68,7.99 25.61,7.99 v26.82,9.19
I2C_SDA  (via drill 0.35)
  Top 0.2: v19.05,17.62 19.05,17.78 19.74,18.47 19.74,24.31 | R1.1 14.85,8.14 v15.9,8.14 16.57,8.14 16.74,7.97
  Top 0.203: v27.94,8.89 27.36,9.47 U1.2 | v20.32,7.41 17.3,7.41 16.74,7.97 | 19.74,24.31 18.97,25.08 18.97,25.24 18.74,25.47 U2.56
  Top 0.254: PAD3.1 12.62,3.35 13.9,4.63 13.9,7.19 R1.1
  Bottom 0.2: v19.05,17.62 19.05,17.01 16.51,14.47 16.51,10.63 16.28,10.4 16.28,8.8 16.14,8.67 16.14,8.38 v15.9,8.14
  Bottom 0.203: v20.32,7.41 26.46,7.41 v27.94,8.89
INT  (via drill 0.35)
  Top 0.2: R4.1 15.88,6.05 | 15.88,6.05 16.25,6.05 16.71,6.51 19.37,6.51 v19.68,6.83 | U2.45 21.58,21.75 20.52,20.68 20.52,17.89 20.44,17.81 v20.44,17.17 | v15.88,6.83 15.88,6.05
  Top 0.203: U1.17 26.06,6.78 v26.08,6.8
  Bottom 0.2: v15.88,6.83 16.5,7.45 16.5,8.52 17.44,9.47 17.44,10.4 17.21,10.63 17.21,14.1 20.28,17.17 v20.44,17.17
  Bottom 0.203: v26.08,6.8 26.06,6.83 20.21,6.83 v19.68,6.83
N$5  (via drill 0.35)
  Top 0.2: U1.18 26.88,5.66 26.88,6.52 27.17,6.8 v28.52,6.8
  Bottom 0.2: v28.52,6.8 30.82,9.11 R12.2
  other vias: 32.23,9.11
N$6
  Top 0.406: LED1.A 32.7,5.24 32.23,5.72 R12.1
N$35
  Top 0.203: R8.2 28.94,12.28 U1.1
NRST
  Top 0.2: U1.4 26.06,8.87 26.67,8.26 30.8,8.26 | 30.8,8.26 31.04,8.02 31.27,7.78 31.27,3.65 | R7.1 31.49,12.28 31.12,11.91 31.12,8.57 30.8,8.26
  Top 0.203: 31.27,3.65 JP1.5
PLVDD  (via drill 0.35)
  Top 0.152: v31.91,29.27 31.46,29.27 U2.26
  Top 0.2: v31.12,26.42 31.56,25.97 U2.21 35.08,25.97 35.69,25.37 | C4.1 33.81,33.56 33.81,30 33.08,29.27 v31.91,29.27 | 35.69,25.37 35.34,25.71 C9.1 35.34,27.88 35.88,28.42 38.42,28.42 39.37,27.46 41.5,27.46 L4.1 | 35.69,25.37 C16.1
  Bottom 0.2: v31.12,26.42 31.12,28.48 v31.91,29.27
R_EXT
  Top 0.152: U2.28 30.08,31.04 31.22,32.17 R6.2
SPDIF  (via drill 0.35)
  Top 0.2: U2.10 30.16,20.47 v30,20.32
  Top 0.254: v15.23,26.73 14.97,26.47 J1.P$2
  Bottom 0.2: v15.23,26.73 15.55,26.73 15.84,26.45 16.97,26.45 20.14,23.27 27.05,23.27 v30,20.32
SWDCLK
  Top 0.254: JP1.2 24.55,0.53 25.4,0.53 28,0.53 28.89,1.43 28.89,4.6 U1.20
SWDIO
  Top 0.254: JP1.4 27.36,2.81 U1.19
TMDS0+
  Top 0.2: U2.36 26.08,31.01 25.98,31.12 25.98,35.64 26.08,35.74 D2.1 D2.10 26.08,39.64 24.55,41.18 J2.P$7
TMDS0-
  Top 0.2: U2.35 26.58,31.04 26.33,31.29 26.33,35.41 26.58,35.66 D2.2 D2.9 26.58,39.78 25.55,40.81 J2.P$9
TMDS1+
  Top 0.2: U2.40 24.08,31.07 24.45,31.43 24.45,35.24 24.08,35.61 D1.4 24.08,38.58 | 24.08,38.58 D1.7 | J2.P$4 23.05,41.25 24.08,40.21 24.08,38.58
TMDS1-
  Top 0.2: U2.39 24.58,31.07 24.8,31.29 24.8,35.39 24.58,35.61 D1.5 D1.6 24.58,40.3 24.05,40.83 J2.P$6
TMDS2+
  Top 0.2: U2.43 22.58,31.08 22.23,31.43 22.23,35.26 22.58,35.62 D1.1 D1.10 22.58,39.81 21.55,40.84 J2.P$1
TMDS2-
  Top 0.2: U2.42 23.08,31.1 22.7,31.49 22.7,35.24 23.08,35.62 D1.2 D1.9 23.08,40.01 22.55,40.54 J2.P$3
TMDSCLK+
  Top 0.2: 27.84,31.29 27.58,31.04 U2.33 | 27.84,31.29 | 27.84,31.29 27.84,35.47 27.58,35.72 D2.4 D2.7 27.58,39.73 26.05,41.26 J2.P$10
TMDSCLK-
  Top 0.2: U2.32 28.08,31.01 28.19,31.12 28.19,35.64 28.08,35.74 D2.5 D2.6 28.08,39.73 27.05,40.76 J2.P$12
VCC  (via drill 0.35)
  Top 0.203: L4.2 41.91,29.69 L2.2
  Top 0.305: L3.2 12.39,29.78 v12.39,28.89
  Top 0.508: v40.16,28.42 41.34,29.59 L4.2
  Top 0.61: VREG1.6 10.81,9.23 v11.59,10 v11.59,10.01
  Bottom 0.508: v12.39,28.89 13.82,27.46 15.54,27.46 16.05,26.95 16.18,26.95 16.21,26.99 17.14,26.99 20.36,23.78 32.83,23.78 37.46,28.42 v40.16,28.42
  Bottom 0.61: v12.39,28.89 13.49,27.79 13.49,24.1 13.49,13.34 11.59,11.44 v11.59,10.01
VSYNC
  Top 0.152: J1.P$20 12.3,17.47 13.08,18.25 R16.6

### Text on the board
tPlace: https://github.com/Ryzee119/ / XboxHDMI-Ryzee119 | Ryzee119 / XboxHDMI | DA | CL | TX